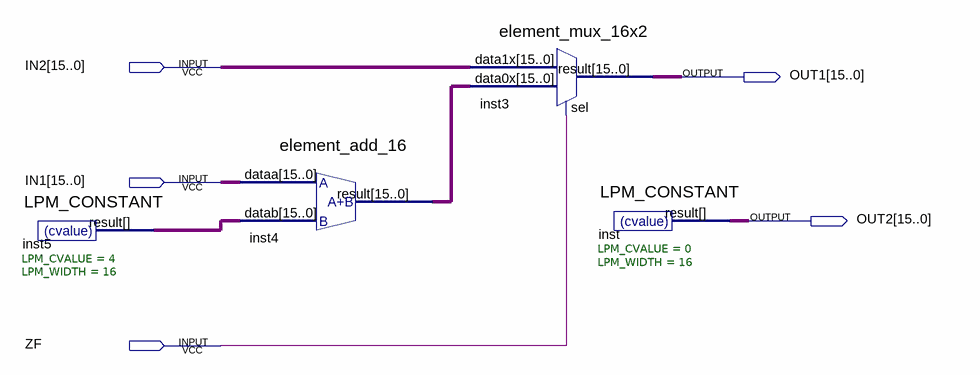
[diagram p0: schematic sheet]
// Quartus schematic block-operation-variant-zcommandselector.bdf as structural Verilog: 4 symbols, 5 pins
module \block-operation-variant-zcommandselector  (
  input  [15:0] IN2,
  input  [15:0] IN1,
  input  ZF,
  output [15:0] OUT1,
  output [15:0] OUT2
);

  wire [15:0] inst4_result, inst5_result;

  LPM_CONSTANT #(.LPM_CVALUE(4), .LPM_WIDTH(16)) inst5 (.result(inst5_result));
  element_add_16 inst4 (.dataa(IN1), .datab(inst5_result), .result(inst4_result));
  element_mux_16x2 inst3 (.data1x(IN2), .data0x(inst4_result), .sel(ZF), .result(OUT1));
  LPM_CONSTANT #(.LPM_CVALUE(0), .LPM_WIDTH(16)) inst (.result(OUT2));
endmodule
